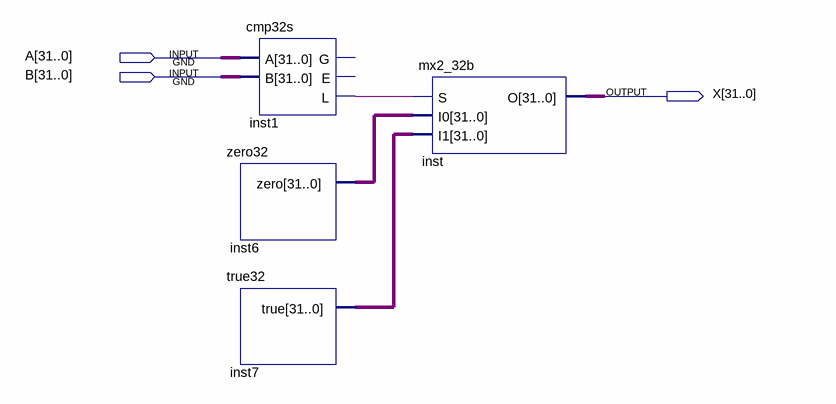
[diagram p0: schematic sheet]
// Quartus schematic slt32.bdf as structural Verilog: 4 symbols, 3 pins
module slt32 (
  input  [31:0] A,
  input  [31:0] B,
  output [31:0] X
);

  wire inst1_l;
  wire [31:0] inst6_zero, inst7_true;

  zero32 inst6 (.zero(inst6_zero));
  true32 inst7 (.true(inst7_true));
  cmp32s inst1 (.A(A), .B(B), .L(inst1_l));  // open: G, E
  mx2_32b inst (.S(inst1_l), .I0(inst6_zero), .I1(inst7_true), .O(X));
endmodule
